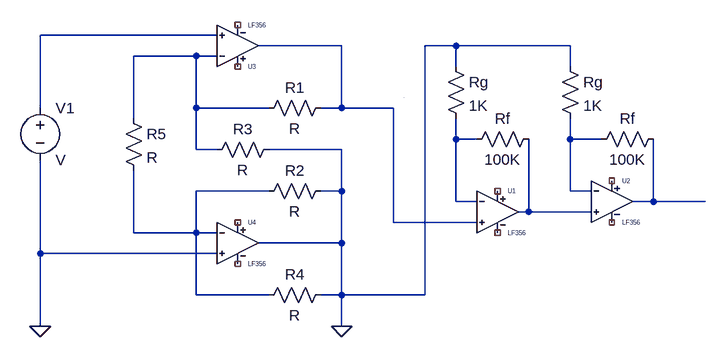
[diagram p0: schematic Draft1.asc]
Draft1.asc, the LTspice schematic file:
Version 4
SHEET 1 880 680
WIRE -288 -96 -560 -96
WIRE -96 -80 -224 -80
WIRE 80 -80 32 -80
WIRE 256 -80 80 -80
WIRE -320 -64 -416 -64
WIRE -288 -64 -320 -64
WIRE 80 -48 80 -80
WIRE 256 -48 256 -80
WIRE -560 16 -560 -96
WIRE -320 16 -320 -64
WIRE -208 16 -320 16
WIRE -96 16 -96 -80
WIRE -96 16 -128 16
WIRE -16 16 -96 16
WIRE -416 32 -416 -64
WIRE 80 64 80 32
WIRE 112 64 80 64
WIRE 256 64 256 32
WIRE 304 64 256 64
WIRE -320 80 -320 16
WIRE -288 80 -320 80
WIRE -96 80 -208 80
WIRE -208 144 -320 144
WIRE -96 144 -96 80
WIRE -96 144 -128 144
WIRE 256 144 256 64
WIRE 288 144 256 144
WIRE 80 160 80 64
WIRE 112 160 80 160
WIRE 384 160 384 64
WIRE 384 160 352 160
WIRE 464 160 384 160
WIRE 192 176 192 64
WIRE 192 176 176 176
WIRE 288 176 192 176
WIRE -16 192 -16 16
WIRE 112 192 -16 192
WIRE -416 208 -416 112
WIRE -320 208 -320 144
WIRE -320 208 -416 208
WIRE -288 208 -320 208
WIRE -96 224 -96 144
WIRE -96 224 -224 224
WIRE -560 240 -560 96
WIRE -288 240 -560 240
WIRE -320 304 -320 208
WIRE -208 304 -320 304
WIRE -96 304 -96 224
WIRE -96 304 -128 304
WIRE 32 304 32 -80
WIRE 32 304 -96 304
WIRE -560 352 -560 240
WIRE -96 352 -96 304
WIRE 0 0 0 0
FLAG -96 352 0
FLAG -560 352 0
SYMBOL LF356 144 112 R0
SYMATTR InstName U1
SYMBOL LF356 320 96 R0
SYMATTR InstName U2
SYMBOL res 208 48 R90
WINDOW 0 0 56 VBottom 2
WINDOW 3 32 56 VTop 2
SYMATTR InstName Rf
SYMATTR Value 100K
SYMBOL res 64 -64 R0
SYMATTR InstName Rg
SYMATTR Value 1K
SYMBOL res 240 -64 R0
SYMATTR InstName Rg
SYMATTR Value 1K
SYMBOL res 400 48 R90
WINDOW 0 0 56 VBottom 2
WINDOW 3 32 56 VTop 2
SYMATTR InstName Rf
SYMATTR Value 100K
SYMBOL LF356 -256 -16 M180
SYMATTR InstName U3
SYMBOL LF356 -256 160 R0
SYMATTR InstName U4
SYMBOL res -112 0 R90
WINDOW 0 0 56 VBottom 2
WINDOW 3 32 56 VTop 2
SYMATTR InstName R1
SYMBOL res -112 128 R90
WINDOW 0 0 56 VBottom 2
WINDOW 3 32 56 VTop 2
SYMATTR InstName R2
SYMBOL res -192 64 R90
WINDOW 0 0 56 VBottom 2
WINDOW 3 32 56 VTop 2
SYMATTR InstName R3
SYMBOL res -112 288 R90
WINDOW 0 0 56 VBottom 2
WINDOW 3 32 56 VTop 2
SYMATTR InstName R4
SYMBOL res -432 16 R0
SYMATTR InstName R5
SYMBOL voltage -560 0 R0
SYMATTR InstName V1

The netlist it stands for:
* Draft1.asc
XU1 N002 N004 NC_01 NC_02 N008 LF356  ; pins In+ In- V+ V- OUT
XU2 N008 N005 NC_03 NC_04 N007 LF356  ; pins In+ In- V+ V- OUT
Rf N008 N004 100K
Rg 0 N004 1K
Rg 0 N005 1K
Rf N007 N005 100K
XU3 N001 N003 NC_05 NC_06 N002 LF356  ; pins In+ In- V+ V- OUT
XU4 0 N006 NC_07 NC_08 0 LF356  ; pins In+ In- V+ V- OUT
R1 N002 N003 R
R2 0 N006 R
R3 0 N003 R
R4 0 N006 R
R5 N003 N006 R
V1 N001 0 V
.lib LF356.sub
.backanno
.end